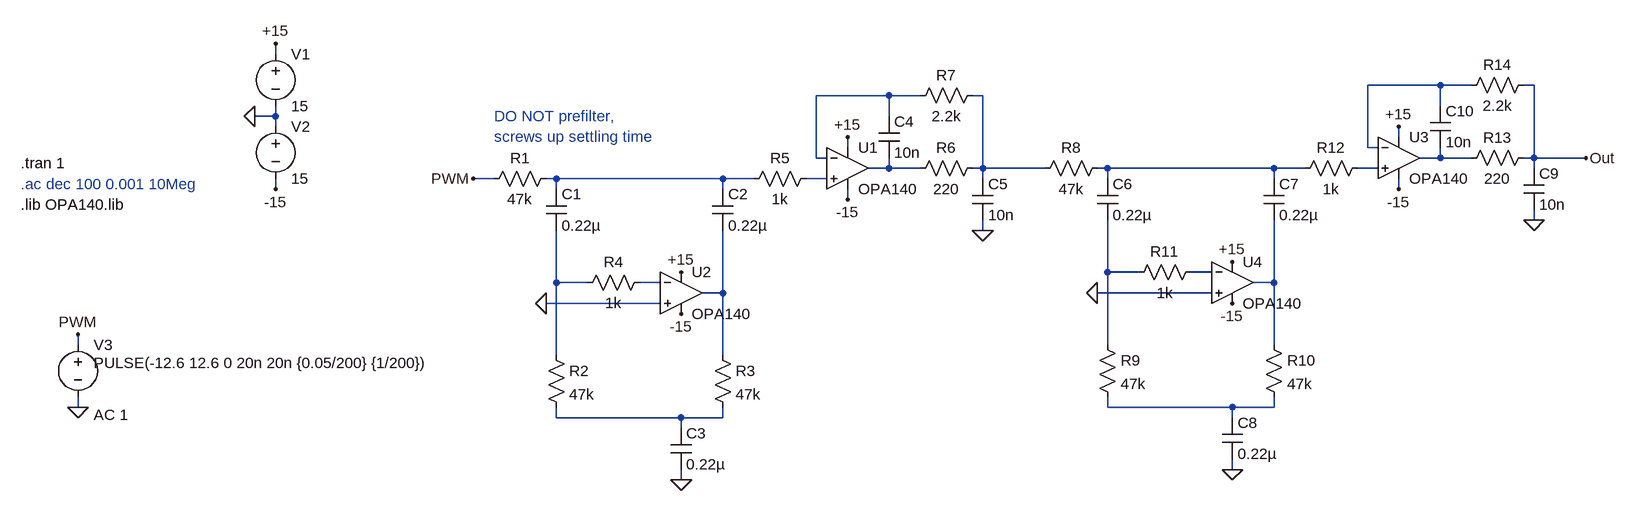
[diagram p0: schematic LPF-A-v1.asc]
LPF-A-v1.asc, the LTspice schematic file:
Version 4
SHEET 1 2256 1140
WIRE -320 -16 -320 -32
WIRE 1472 32 1360 32
WIRE 1520 32 1472 32
WIRE 1616 32 1600 32
WIRE 624 48 512 48
WIRE 672 48 624 48
WIRE 768 48 752 48
WIRE 1472 64 1472 32
WIRE -320 80 -320 64
WIRE -320 80 -352 80
WIRE 624 80 624 48
WIRE -320 96 -320 80
WIRE 1408 112 1408 96
WIRE 560 128 560 112
WIRE 1360 128 1360 32
WIRE 1376 128 1360 128
WIRE 512 144 512 48
WIRE 528 144 512 144
WIRE 1472 144 1472 128
WIRE 1472 144 1440 144
WIRE 1520 144 1472 144
WIRE 1616 144 1616 32
WIRE 1616 144 1600 144
WIRE 1696 144 1616 144
WIRE 624 160 624 144
WIRE 624 160 592 160
WIRE 672 160 624 160
WIRE 768 160 768 48
WIRE 768 160 752 160
WIRE 864 160 768 160
WIRE 960 160 944 160
WIRE 1216 160 960 160
WIRE 1264 160 1216 160
WIRE 1376 160 1344 160
WIRE 1616 160 1616 144
WIRE 16 176 -16 176
WIRE 112 176 96 176
WIRE 368 176 112 176
WIRE 416 176 368 176
WIRE 528 176 496 176
WIRE 768 176 768 160
WIRE 960 176 960 160
WIRE 1216 176 1216 160
WIRE -320 192 -320 176
WIRE 112 192 112 176
WIRE 368 192 368 176
WIRE 1408 192 1408 176
WIRE 560 208 560 192
WIRE 1616 240 1616 224
WIRE 768 256 768 240
WIRE 960 320 960 240
WIRE 1008 320 960 320
WIRE 1120 320 1088 320
WIRE 112 336 112 256
WIRE 160 336 112 336
WIRE 272 336 240 336
WIRE 1216 336 1216 240
WIRE 1216 336 1184 336
WIRE 368 352 368 256
WIRE 368 352 336 352
WIRE 1120 352 944 352
WIRE 272 368 96 368
WIRE -624 432 -624 416
WIRE 960 432 960 320
WIRE 1216 432 1216 336
WIRE 112 448 112 336
WIRE 368 448 368 352
WIRE -624 528 -624 512
WIRE 960 528 960 512
WIRE 1152 528 960 528
WIRE 1216 528 1216 512
WIRE 1216 528 1152 528
WIRE 112 544 112 528
WIRE 304 544 112 544
WIRE 368 544 368 528
WIRE 368 544 304 544
WIRE 1152 544 1152 528
WIRE 304 560 304 544
WIRE 1152 624 1152 608
WIRE 304 640 304 624
FLAG -352 80 0
FLAG 560 112 +15
FLAG 304 320 +15
FLAG 96 368 0
FLAG 304 640 0
FLAG 304 384 -15
FLAG -624 528 0
FLAG 1696 144 Out
FLAG -320 -32 +15
FLAG -320 192 -15
FLAG 560 208 -15
FLAG -624 416 PWM
FLAG -16 176 PWM
FLAG 768 256 0
FLAG 1408 96 +15
FLAG 1152 304 +15
FLAG 944 352 0
FLAG 1152 624 0
FLAG 1152 368 -15
FLAG 1408 192 -15
FLAG 1616 240 0
SYMBOL OpAmps\\opamp2 560 96 R0
SYMATTR InstName U1
SYMATTR Value OPA140
SYMBOL voltage -320 -32 R0
WINDOW 123 0 0 Left 0
WINDOW 39 0 0 Left 0
SYMATTR InstName V1
SYMATTR Value 15
SYMBOL voltage -320 80 R0
WINDOW 123 0 0 Left 0
WINDOW 39 0 0 Left 0
SYMATTR InstName V2
SYMATTR Value 15
SYMBOL res 112 160 R90
WINDOW 0 0 56 VBottom 2
WINDOW 3 32 56 VTop 2
SYMATTR InstName R1
SYMATTR Value 47k
SYMBOL cap 96 192 R0
SYMATTR InstName C1
SYMATTR Value 0.22µ
SYMBOL cap 352 192 R0
SYMATTR InstName C2
SYMATTR Value 0.22µ
SYMBOL OpAmps\\opamp2 304 288 R0
SYMATTR InstName U2
SYMATTR Value OPA140
SYMBOL res 96 432 R0
SYMATTR InstName R2
SYMATTR Value 47k
SYMBOL res 352 432 R0
SYMATTR InstName R3
SYMATTR Value 47k
SYMBOL voltage -624 416 R0
WINDOW 123 24 124 Left 2
WINDOW 39 0 0 Left 0
WINDOW 3 24 44 Left 2
SYMATTR Value2 AC 1
SYMATTR Value PULSE(-12.6 12.6 0 20n 20n {0.05/200} {1/200})
SYMATTR InstName V3
SYMBOL cap 288 560 R0
SYMATTR InstName C3
SYMATTR Value 0.22µ
SYMBOL res 256 320 R90
WINDOW 0 0 56 VBottom 2
WINDOW 3 32 56 VTop 2
SYMATTR InstName R4
SYMATTR Value 1k
SYMBOL res 512 160 R90
WINDOW 0 0 56 VBottom 2
WINDOW 3 32 56 VTop 2
SYMATTR InstName R5
SYMATTR Value 1k
SYMBOL res 768 144 R90
WINDOW 0 0 56 VBottom 2
WINDOW 3 32 56 VTop 2
SYMATTR InstName R6
SYMATTR Value 220
SYMBOL cap 752 176 R0
SYMATTR InstName C5
SYMATTR Value 10n
SYMBOL res 768 32 R90
WINDOW 0 0 56 VBottom 2
WINDOW 3 32 56 VTop 2
SYMATTR InstName R7
SYMATTR Value 2.2k
SYMBOL cap 608 80 R0
SYMATTR InstName C4
SYMATTR Value 10n
SYMBOL OpAmps\\opamp2 1408 80 R0
SYMATTR InstName U3
SYMATTR Value OPA140
SYMBOL res 960 144 R90
WINDOW 0 0 56 VBottom 2
WINDOW 3 32 56 VTop 2
SYMATTR InstName R8
SYMATTR Value 47k
SYMBOL cap 944 176 R0
SYMATTR InstName C6
SYMATTR Value 0.22µ
SYMBOL cap 1200 176 R0
SYMATTR InstName C7
SYMATTR Value 0.22µ
SYMBOL OpAmps\\opamp2 1152 272 R0
SYMATTR InstName U4
SYMATTR Value OPA140
SYMBOL res 944 416 R0
SYMATTR InstName R9
SYMATTR Value 47k
SYMBOL res 1200 416 R0
SYMATTR InstName R10
SYMATTR Value 47k
SYMBOL cap 1136 544 R0
SYMATTR InstName C8
SYMATTR Value 0.22µ
SYMBOL res 1104 304 R90
WINDOW 0 0 56 VBottom 2
WINDOW 3 32 56 VTop 2
SYMATTR InstName R11
SYMATTR Value 1k
SYMBOL res 1360 144 R90
WINDOW 0 0 56 VBottom 2
WINDOW 3 32 56 VTop 2
SYMATTR InstName R12
SYMATTR Value 1k
SYMBOL res 1616 128 R90
WINDOW 0 0 56 VBottom 2
WINDOW 3 32 56 VTop 2
SYMATTR InstName R13
SYMATTR Value 220
SYMBOL cap 1600 160 R0
SYMATTR InstName C9
SYMATTR Value 10n
SYMBOL res 1616 16 R90
WINDOW 0 0 56 VBottom 2
WINDOW 3 32 56 VTop 2
SYMATTR InstName R14
SYMATTR Value 2.2k
SYMBOL cap 1456 64 R0
SYMATTR InstName C10
SYMATTR Value 10n
TEXT -712 216 Left 2 !.lib OPA140.lib
TEXT -712 184 Left 2 ;.ac dec 100 0.001 10Meg
TEXT 16 80 Left 2 ;DO NOT prefilter,\nscrews up settling time
TEXT -712 152 Left 2 !.tran 1

The netlist it stands for:
* LPF-A-v1.asc
XU1 N009 N002 +15 -15 N005 OPA140  ; pins In+ In- V+ V- OUT
V1 +15 0 15
V2 0 -15 15
R1 N008 PWM 47k
C1 N008 N012 0.22µ
C2 N008 N015 0.22µ
XU2 0 N013 +15 -15 N015 OPA140  ; pins In+ In- V+ V- OUT
R2 N012 N017 47k
R3 N015 N017 47k
V3 PWM 0 PULSE(-12.6 12.6 0 20n 20n {0.05/200} {1/200}) AC 1
C3 N017 0 0.22µ
R4 N013 N012 1k
R5 N009 N008 1k
R6 N003 N005 220
C5 N003 0 10n
R7 N003 N002 2.2k
C4 N002 N005 10n
XU3 N007 N001 +15 -15 N004 OPA140  ; pins In+ In- V+ V- OUT
R8 N006 N003 47k
C6 N006 N010 0.22µ
C7 N006 N014 0.22µ
XU4 0 N011 +15 -15 N014 OPA140  ; pins In+ In- V+ V- OUT
R9 N010 N016 47k
R10 N014 N016 47k
C8 N016 0 0.22µ
R11 N011 N010 1k
R12 N007 N006 1k
R13 Out N004 220
C9 Out 0 10n
R14 Out N001 2.2k
C10 N001 N004 10n
.lib OPA140.lib
* .ac dec 100 0.001 10Meg
* DO NOT prefilter,
* screws up settling time
.tran 1
.backanno
.end